# EAGLE schematic Z80_Memory (EAGLE 5.11)
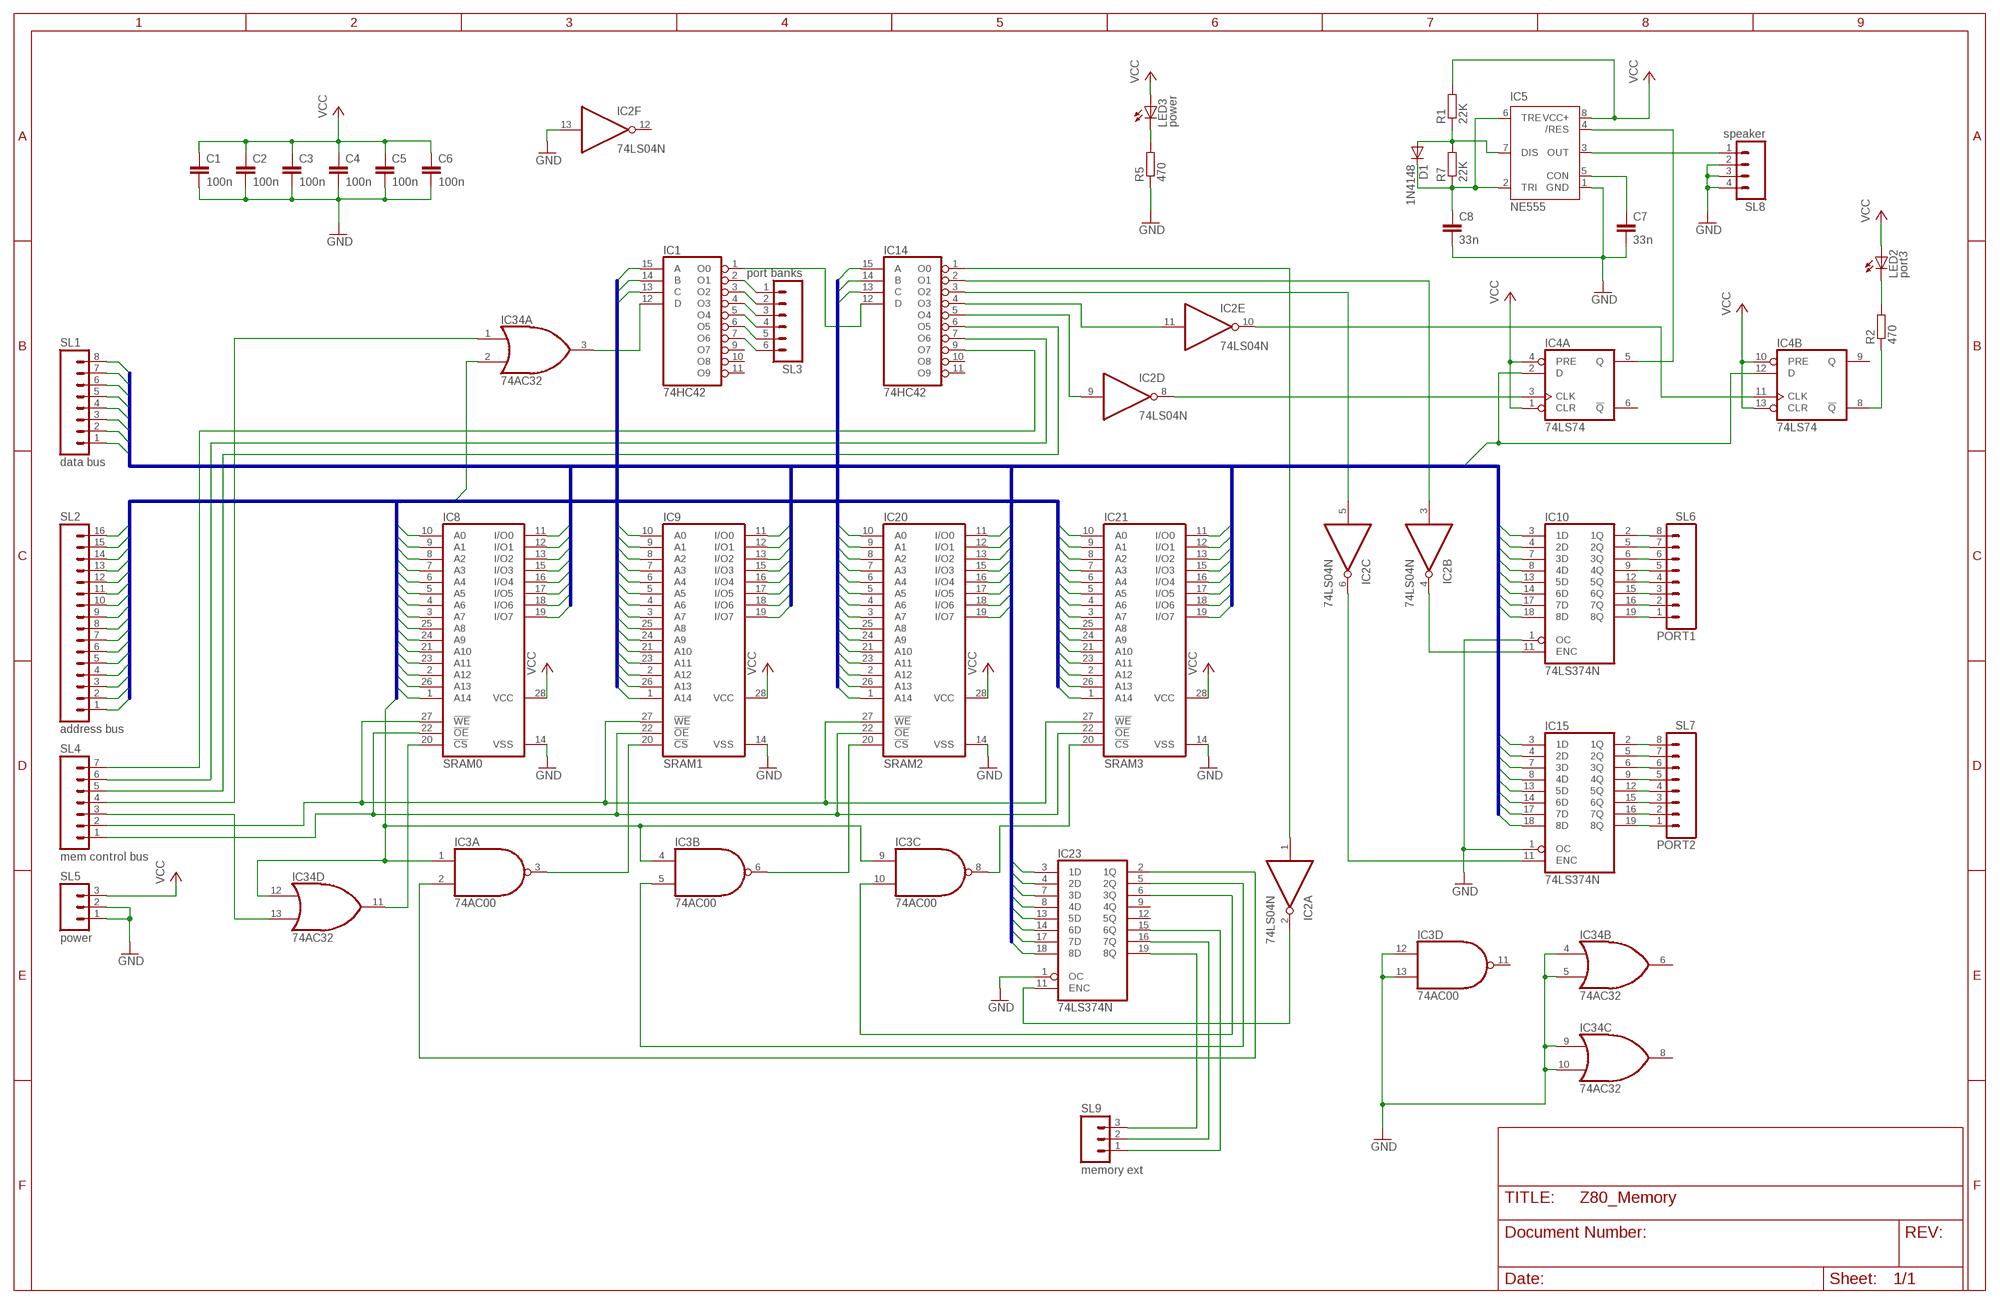
[diagram p0: schematic, sheet 1]

## Parts
C1  100n  C-EU050-030X075  [C050-030X075]
C2  100n  C-EU050-030X075  [C050-030X075]
C3  100n  C-EU050-030X075  [C050-030X075]
C4  100n  C-EU050-030X075  [C050-030X075]
C5  100n  C-EU050-030X075  [C050-030X075]
C6  100n  C-EU050-030X075  [C050-030X075]
C7  33n  C-EU050-024X044  [C050-024X044]
C8  33n  C-EU050-024X044  [C050-024X044]
D1  1N4148  DIODE-D-2.5  [D-2.5]
IC1  74HC42  74LS42N  [DIL16]
IC2  74LS04N  [DIL14]
IC3  74AC00  7400N  [DIL14]
IC4  74LS74  74LS74N  [DIL14]
IC5  NE555  [DIL-08]
IC8  SRAM0  62832P  [DIL28-3]
IC9  SRAM1  62832P  [DIL28-3]
IC10  74LS374N  74LS373N  [DIL20]
IC14  74HC42  74LS42N  [DIL16]
IC15  74LS374N  74LS373N  [DIL20]
IC20  SRAM2  62832P  [DIL28-3]
IC21  SRAM3  62832P  [DIL28-3]
IC23  74LS374N  74LS373N  [DIL20]
IC34  74AC32  7432N  [DIL14]
LED2  port3  LED5MM  [LED5MM]
LED3  power  LED5MM  [LED5MM]
R1  22K  R-EU_0207/10  [0207/10]
R2  470  R-EU_0207/10  [0207/10]
R5  470  R-EU_0207/10  [0207/10]
R7  22K  R-EU_0207/2V  [0207/2V]
SL1  data bus  M08  [08P]
SL2  address bus  M16  [16P]
SL3  port banks  M06  [06P]
SL4  mem control bus  M07  [07P]
SL5  power  M03  [03P]
SL6  PORT1  M08  [08P]
SL7  PORT2  M08  [08P]
SL8  speaker  M04  [04P]
SL9  memory ext  M03  [03P]

## Nets
/CS_RAM0: IC8.20(!CS) IC34.11(D:O)
/CS_RAM1: IC3.3(A:O) IC9.20(!CS)
/CS_RAM2: IC3.6(B:O) IC20.20(!CS)
/CS_RAM3: IC3.8(C:O) IC21.20(!CS)
/EN_RAM0: IC34.13(D:I1) SL4.3
/IOWR: IC34.1(A:I0) SL4.4
/IOWR_BLOCK0: IC1.1(O0) IC14.12(D)
/IOWR_BLOCK1: IC1.2(O1) SL3.1
/IOWR_BLOCK2: IC1.3(O2) SL3.2
/IOWR_BLOCK3: IC1.4(O3) SL3.3
/IOWR_BLOCK4: IC1.5(O4) SL3.4
/IOWR_BLOCK5: IC1.6(O5) SL3.5
/IOWR_BLOCK6: IC1.7(O6) SL3.6
/MEMRD: IC8.22(!OE) IC9.22(!OE) IC20.22(!OE) IC21.22(!OE) SL4.1
/MEMWR: IC8.27(!WE) IC9.27(!WE) IC20.27(!WE) IC21.27(!WE) SL4.2
/WR_PORT0: IC2.1(A:I) IC14.1(O0)
/WR_PORT1: IC2.3(B:I) IC14.2(O1)
/WR_PORT2: IC2.5(C:I) IC14.3(O2)
/WR_PORT3: IC2.11(E:I) IC14.4(O3)
/WR_PORT4: IC2.9(D:I) IC14.5(O4)
/WR_PORT5: IC14.6(O5) SL4.5
/WR_PORT6: IC14.7(O6) SL4.6
/WR_PORT7: IC14.9(O7) SL4.7
AB0: IC8.10(A0) IC9.10(A0) IC14.15(A) IC20.10(A0) IC21.10(A0) SL2.1
AB1: IC8.9(A1) IC9.9(A1) IC14.14(B) IC20.9(A1) IC21.9(A1) SL2.2
AB2: IC8.8(A2) IC9.8(A2) IC14.13(C) IC20.8(A2) IC21.8(A2) SL2.3
AB3: IC1.15(A) IC8.7(A3) IC9.7(A3) IC20.7(A3) IC21.7(A3) SL2.4
AB4: IC1.14(B) IC8.6(A4) IC9.6(A4) IC20.6(A4) IC21.6(A4) SL2.5
AB5: IC1.13(C) IC8.5(A5) IC9.5(A5) IC20.5(A5) IC21.5(A5) SL2.6
AB6: IC8.4(A6) IC9.4(A6) IC20.4(A6) IC21.4(A6) SL2.7
AB7: IC8.3(A7) IC9.3(A7) IC20.3(A7) IC21.3(A7) IC34.2(A:I1) SL2.8
AB8: IC8.25(A8) IC9.25(A8) IC20.25(A8) IC21.25(A8) SL2.9
AB9: IC8.24(A9) IC9.24(A9) IC20.24(A9) IC21.24(A9) SL2.10
AB10: IC8.21(A10) IC9.21(A10) IC20.21(A10) IC21.21(A10) SL2.11
AB11: IC8.23(A11) IC9.23(A11) IC20.23(A11) IC21.23(A11) SL2.12
AB12: IC8.2(A12) IC9.2(A12) IC20.2(A12) IC21.2(A12) SL2.13
AB13: IC8.26(A13) IC9.26(A13) IC20.26(A13) IC21.26(A13) SL2.14
AB14: IC8.1(A14) IC9.1(A14) IC20.1(A14) IC21.1(A14) SL2.15
AB15: IC3.1(A:I0) IC3.4(B:I0) IC3.9(C:I0) IC34.12(D:I0) SL2.16
DB0: IC4.2(A:D) IC4.12(B:D) IC8.11(I/O0) IC9.11(I/O0) IC10.3(1D) IC15.3(1D) IC20.11(I/O0) IC21.11(I/O0) IC23.3(1D) SL1.1
DB1: IC8.12(I/O1) IC9.12(I/O1) IC10.4(2D) IC15.4(2D) IC20.12(I/O1) IC21.12(I/O1) IC23.4(2D) SL1.2
DB2: IC8.13(I/O2) IC9.13(I/O2) IC10.7(3D) IC15.7(3D) IC20.13(I/O2) IC21.13(I/O2) IC23.7(3D) SL1.3
DB3: IC8.15(I/O3) IC9.15(I/O3) IC10.8(4D) IC15.8(4D) IC20.15(I/O3) IC21.15(I/O3) IC23.8(4D) SL1.4
DB4: IC8.16(I/O4) IC9.16(I/O4) IC10.13(5D) IC15.13(5D) IC20.16(I/O4) IC21.16(I/O4) IC23.13(5D) SL1.5
DB5: IC8.17(I/O5) IC9.17(I/O5) IC10.14(6D) IC15.14(6D) IC20.17(I/O5) IC21.17(I/O5) IC23.14(6D) SL1.6
DB6: IC8.18(I/O6) IC9.18(I/O6) IC10.17(7D) IC15.17(7D) IC20.18(I/O6) IC21.18(I/O6) IC23.17(7D) SL1.7
DB7: IC8.19(I/O7) IC9.19(I/O7) IC10.18(8D) IC15.18(8D) IC20.19(I/O7) IC21.19(I/O7) IC23.18(8D) SL1.8
EN_RAM1: IC3.2(A:I1) IC23.2(1Q)
EN_RAM2: IC3.5(B:I1) IC23.5(2Q)
EN_RAM3: IC3.10(C:I1) IC23.6(3Q)
GND: C1.2 C2.2 C3.2 C4.2 C5.2 C6.2 C7.2 C8.2 IC2.13(F:I) IC3.12(D:I0) IC3.13(D:I1) IC5.1(GND) IC8.14(VSS) IC9.14(VSS) IC10.1(OC) IC15.1(OC) IC20.14(VSS) IC21.14(VSS) IC23.1(OC) IC34.4(B:I0) IC34.5(B:I1) IC34.9(C:I0) IC34.10(C:I1) R5.1 SL5.1 SL5.2 SL8.2 SL8.3 SL8.4
N$2: IC23.16(7Q) SL9.2
N$3: IC4.5(A:Q) IC5.4(/RES)
N$4: IC23.19(8Q) SL9.3
N$5: D1.A IC5.7(DIS) R1.1 R7.2
N$6: IC2.2(A:O) IC23.11(ENC)
N$7: IC1.12(D) IC34.3(A:O)
N$8: C8.1 D1.C IC5.2(TRI) IC5.6(TRE) R7.1
N$9: IC23.15(6Q) SL9.1
N$10: IC4.8(B:!Q) R2.1
N$11: IC5.3(OUT) SL8.1
N$12: C7.1 IC5.5(CON)
N$32: LED2.K(C) R2.2
N$34: LED3.K(C) R5.2
PORT1_0: IC10.2(1Q) SL6.8
PORT1_1: IC10.5(2Q) SL6.7
PORT1_2: IC10.6(3Q) SL6.6
PORT1_3: IC10.9(4Q) SL6.5
PORT1_4: IC10.12(5Q) SL6.4
PORT1_5: IC10.15(6Q) SL6.3
PORT1_6: IC10.16(7Q) SL6.2
PORT1_7: IC10.19(8Q) SL6.1
PORT2_0: IC15.2(1Q) SL7.8
PORT2_1: IC15.5(2Q) SL7.7
PORT2_2: IC15.6(3Q) SL7.6
PORT2_3: IC15.9(4Q) SL7.5
PORT2_4: IC15.12(5Q) SL7.4
PORT2_5: IC15.15(6Q) SL7.3
PORT2_6: IC15.16(7Q) SL7.2
PORT2_7: IC15.19(8Q) SL7.1
VCC: C1.1 C2.1 C3.1 C4.1 C5.1 C6.1 IC4.1(A:CLR) IC4.4(A:PRE) IC4.10(B:PRE) IC4.13(B:CLR) IC5.8(VCC+) IC8.28(VCC) IC9.28(VCC) IC20.28(VCC) IC21.28(VCC) LED2.A LED3.A R1.2 SL5.3
WR_PORT1: IC2.4(B:O) IC10.11(ENC)
WR_PORT2: IC2.6(C:O) IC15.11(ENC)
WR_PORT3: IC2.10(E:O) IC4.11(B:CLK)
WR_PORT4: IC2.8(D:O) IC4.3(A:CLK)
Unconnected: IC1.9(O7) IC1.10(O8) IC1.11(O9) IC2.12(F:O) IC3.11(D:O) IC4.6(A:!Q) IC4.9(B:Q) IC14.10(O8) IC14.11(O9) IC23.9(4Q) IC23.12(5Q) IC34.6(B:O) IC34.8(C:O)

## Buses
AB[0..15]
DB[0..7]

## Power pins joined to a net without a drawn wire
GND: IC1.8(GND) IC2.7(P:GND) IC3.7(P:GND) IC4.7(P:GND) IC10.10(GND) IC14.8(GND) IC15.10(GND) IC23.10(GND) IC34.7(P:GND)
VCC: IC1.16(VCC) IC2.14(P:VCC) IC3.14(P:VCC) IC4.14(P:VCC) IC10.20(VCC) IC14.16(VCC) IC15.20(VCC) IC23.20(VCC) IC34.14(P:VCC)

## Library data of the parts
C1-C8 = rcl:C-EU: CAPACITOR, European symbol
D1 = diode:DIODE-: DIODE
IC1 IC14 = 74xx-eu:74*42: 4-line to 10-line DECODER (1-of-10)
IC2 = 74xx-eu:74*04: Hex INVERTER
IC3 = 74xx-us:74*00: Quad 2-input NAND gate
IC4 = 74xx-eu:74*74: Dual D type positive edge triggered FLIP FLOP, preset and clear
IC5 = st-microelectronics:NE555: General purpose bipolar Timer
IC8 IC9 IC20 IC21 = memory-hitachi:62832P: MEMORY
IC10 IC15 IC23 = 74xx-us:74*373: Octal D type transparent LATCH, edge triggered
IC34 = 74xx-us:74*32: Quad 2-input OR gate
LED2 LED3 = led:LED: LED OSRAM: - CHIPLED LG R971, LG N971, LY N971, LG Q971, LY Q971, LO R971, LY R971 LH N974, LH R974 LS Q976, LO Q976, LY Q976 LO Q996 - Hyper CHIPLED LW Q18S LB Q993, LB Q99A, LB R99A - SideLED LS A670, LO A670, LY A670, LG A670, LP A670 LB A673, LV A673, LT A673, LW A673 LH A674 LY A675 LS A676, LA A676, LO A676, LY A676, LW A676 LS A679, LY A679, LG A679 - Hyper Micro SIDELED® LS Y876, LA Y876, LO Y876, LY Y876 LT Y87S - SmartLED LW L88C, LW L88S LB L89C, LB L89S, LG L890 LS L89K, LO L89K, LY L89K LS L896, LA L896, LO L896, LY L896 - TOPLED LS T670, LO T670, LY T670, LG T670, LP T670 LSG T670, LSP T670, LSY T670, LOP T670, LYG T670 LG T671, LOG T671, LSG T671 LB T673, LV T673, LT T673, LW T673 LH T674 LS T676, LA T676, LO T676, LY T676, LB T676, LH T676, LSB T676, LW T676 LB T67C, LV T67C, LT T67C, LS T67K, LO T67K, LY T67K, LW E67C LS E67B, LA E67B, LO E67B, LY E67B, LB E67C, LV E67C, LT E67C LW T67C LS T679, LY T679, LG T679 LS T770, LO T770, LY T770, LG T770, LP T770 LB T773, LV T773, LT T773, LW T773 LH T774 LS E675, LA E675, LY E675, LS T675 LS T776, LA T776, LO T776, LY T776, LB T776 LHGB T686 LT T68C, LB T68C - Hyper Mini TOPLED® LB M676 - Mini TOPLED Santana® LG M470 LS M47K, LO M47K, LY M47K Source: http://www.osram.convergy.de LUXEON: - LUMILED® LXK2-PW12-R00, LXK2-PW12-S00, LXK2-PW14-U00, LXK2-PW14-V00 LXK2-PM12-R00, LXK2-PM12-S00, LXK2-PM14-U00 LXK2-PE12-Q00, LXK2-PE12-R00, LXK2-PE12-S00, LXK2-PE14-T00, LXK2-PE14-U00 LXK2-PB12-K00, LXK2-PB12-L00, LXK2-PB12-M00, LXK2-PB14-N00, LXK2-PB14-P00, LXK2-PB14-Q00 LXK2-PR12-L00, LXK2-PR12-M00, LXK2-PR14-Q00, LXK2-PR14-R00 LXK2-PD12-Q00, LXK2-PD12-R00, LXK2-PD12-S00 LXK2-PH12-R00, LXK2-PH12-S00 LXK2-PL12-P00, LXK2-PL12-Q00, LXK2-PL12-R00 Source: www.luxeon.com KINGBRIGHT: KA-3528ASYC Source: www.kingbright.com
R1 R2 R5 R7 = rcl:R-EU_: RESISTOR, European symbol
SL1 SL6 SL7 = con-amp-quick:M08: AMP QUICK CONNECTOR
SL2 = con-amp-quick:M16: AMP QUICK CONNECTOR
SL3 = con-amp-quick:M06: AMP QUICK CONNECTOR
SL4 = con-amp-quick:M07: AMP QUICK CONNECTOR
SL5 SL9 = con-amp-quick:M03: AMP QUICK CONNECTOR
SL8 = con-amp-quick:M04: AMP QUICK CONNECTOR